# EAGLE schematic Hat_Schaltplan_1.2 (EAGLE 9.6.2)

## Sheet 1 of 2
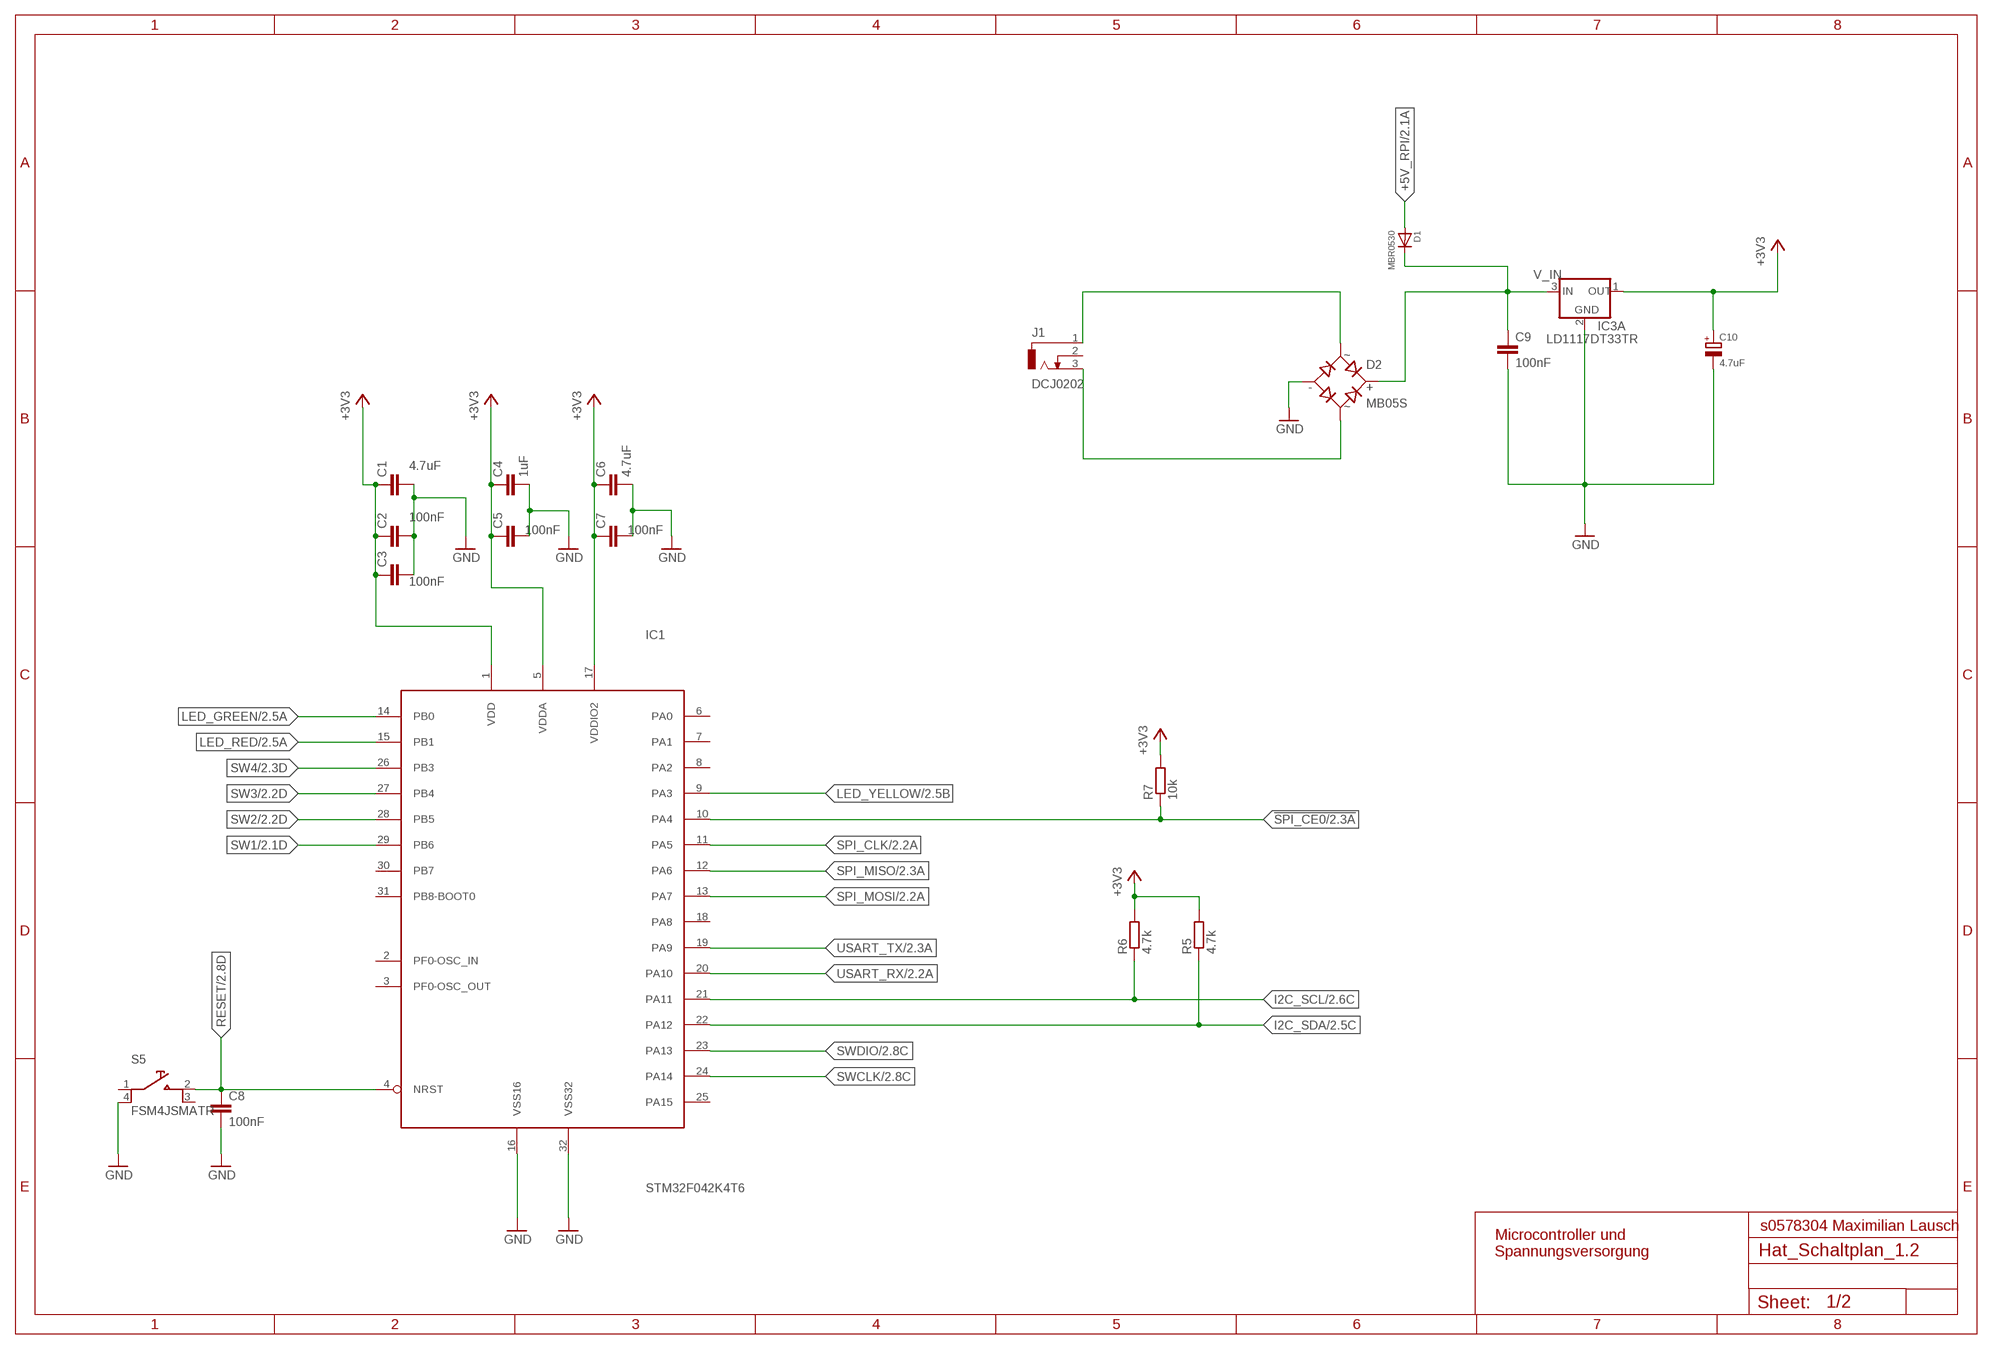
[diagram p0: schematic, sheet 1]

### Parts
C1  4.7uF  C-EUC0603  [C0603]
C2  100nF  C-EUC0603  [C0603]
C3  100nF  C-EUC0603  [C0603]
C4  1uF  C-EUC0603  [C0603]
C5  100nF  C-EUC0603  [C0603]
C6  4.7uF  C-EUC0603  [C0603]
C7  100nF  C-EUC0603  [C0603]
C8  100nF  C-EUC0603  [C0603]
C9  100nF  C-EUC0603  [C0603]
C10  4.7uF  WX-SERIES-5MM  [WX5MM]
D1  MBR0530  [SOD123]
D2  MB05S  SF-SERIES-MINI-DIL  [MINIDIL]
IC1  STM32F042K4T6  [LQPF32]
IC3  LD1117DT33TR  L78XXSOT89  [SOT89R]
J1  DCJ0202  [DCJ0202]
R5  4.7k  R-EU_R0603  [R0603]
R6  4.7k  R-EU_R0603  [R0603]
R7  10k  R-EU_R0603  [R0603]
S5  FSM4JSMATR  [FSM4JSMATR]

### Nets
!SPI_CE0: IC1.10(PA4) R7.1 ; also sheet 2
+3V3: C1.1 C2.1 C3.1 C4.1 C5.1 C6.1 C7.1 C10.+ IC1.1(VDD) IC1.5(VDDA) IC1.17(VDDIO2) IC3.1(A:OUT) R5.2 R6.2 R7.2 ; also sheet 2
+5V_RPI: D1.A ; also sheet 2
GND: C1.2 C2.2 C3.2 C4.2 C5.2 C6.2 C7.2 C8.2 C9.2 C10.- D2.- IC1.16(VSS16) IC1.32(VSS32) IC3.2(A:GND) S5.4 ; also sheet 2
I2C_SCL: IC1.21(PA11) R6.1 ; also sheet 2
I2C_SDA: IC1.22(PA12) R5.1 ; also sheet 2
LED_GREEN: IC1.14(PB0) ; also sheet 2
LED_RED: IC1.15(PB1) ; also sheet 2
LED_YELLOW: IC1.9(PA3) ; also sheet 2
N$4: D2.4(AC2) J1.3
N$5: D2.3(AC1) J1.1
RESET: C8.1 IC1.4(NRST) S5.2 ; also sheet 2
SPI_CLK: IC1.11(PA5) ; also sheet 2
SPI_MISO: IC1.12(PA6) ; also sheet 2
SPI_MOSI: IC1.13(PA7) ; also sheet 2
SW1: IC1.29(PB6) ; also sheet 2
SW2: IC1.28(PB5) ; also sheet 2
SW3: IC1.27(PB4) ; also sheet 2
SW4: IC1.26(PB3) ; also sheet 2
SWCLK: IC1.24(PA14) ; also sheet 2
SWDIO: IC1.23(PA13) ; also sheet 2
USART_RX: IC1.20(PA10) ; also sheet 2
USART_TX: IC1.19(PA9) ; also sheet 2
V_IN: C9.1 D1.K D2.+ IC3.3(A:IN)
Unconnected: IC1.2(PF0-OSC_IN) IC1.3(PF0-OSC_OUT) IC1.6(PA0) IC1.7(PA1) IC1.8(PA2) IC1.18(PA8) IC1.25(PA15) IC1.30(PB7) IC1.31(PB8-BOOT0) IC3.4 J1.2 S5.1 S5.3

### Notes on the sheet
- s0578304 Maximilian Lausch
- Microcontroller und 
  Spannungsversorgung

## Sheet 2 of 2
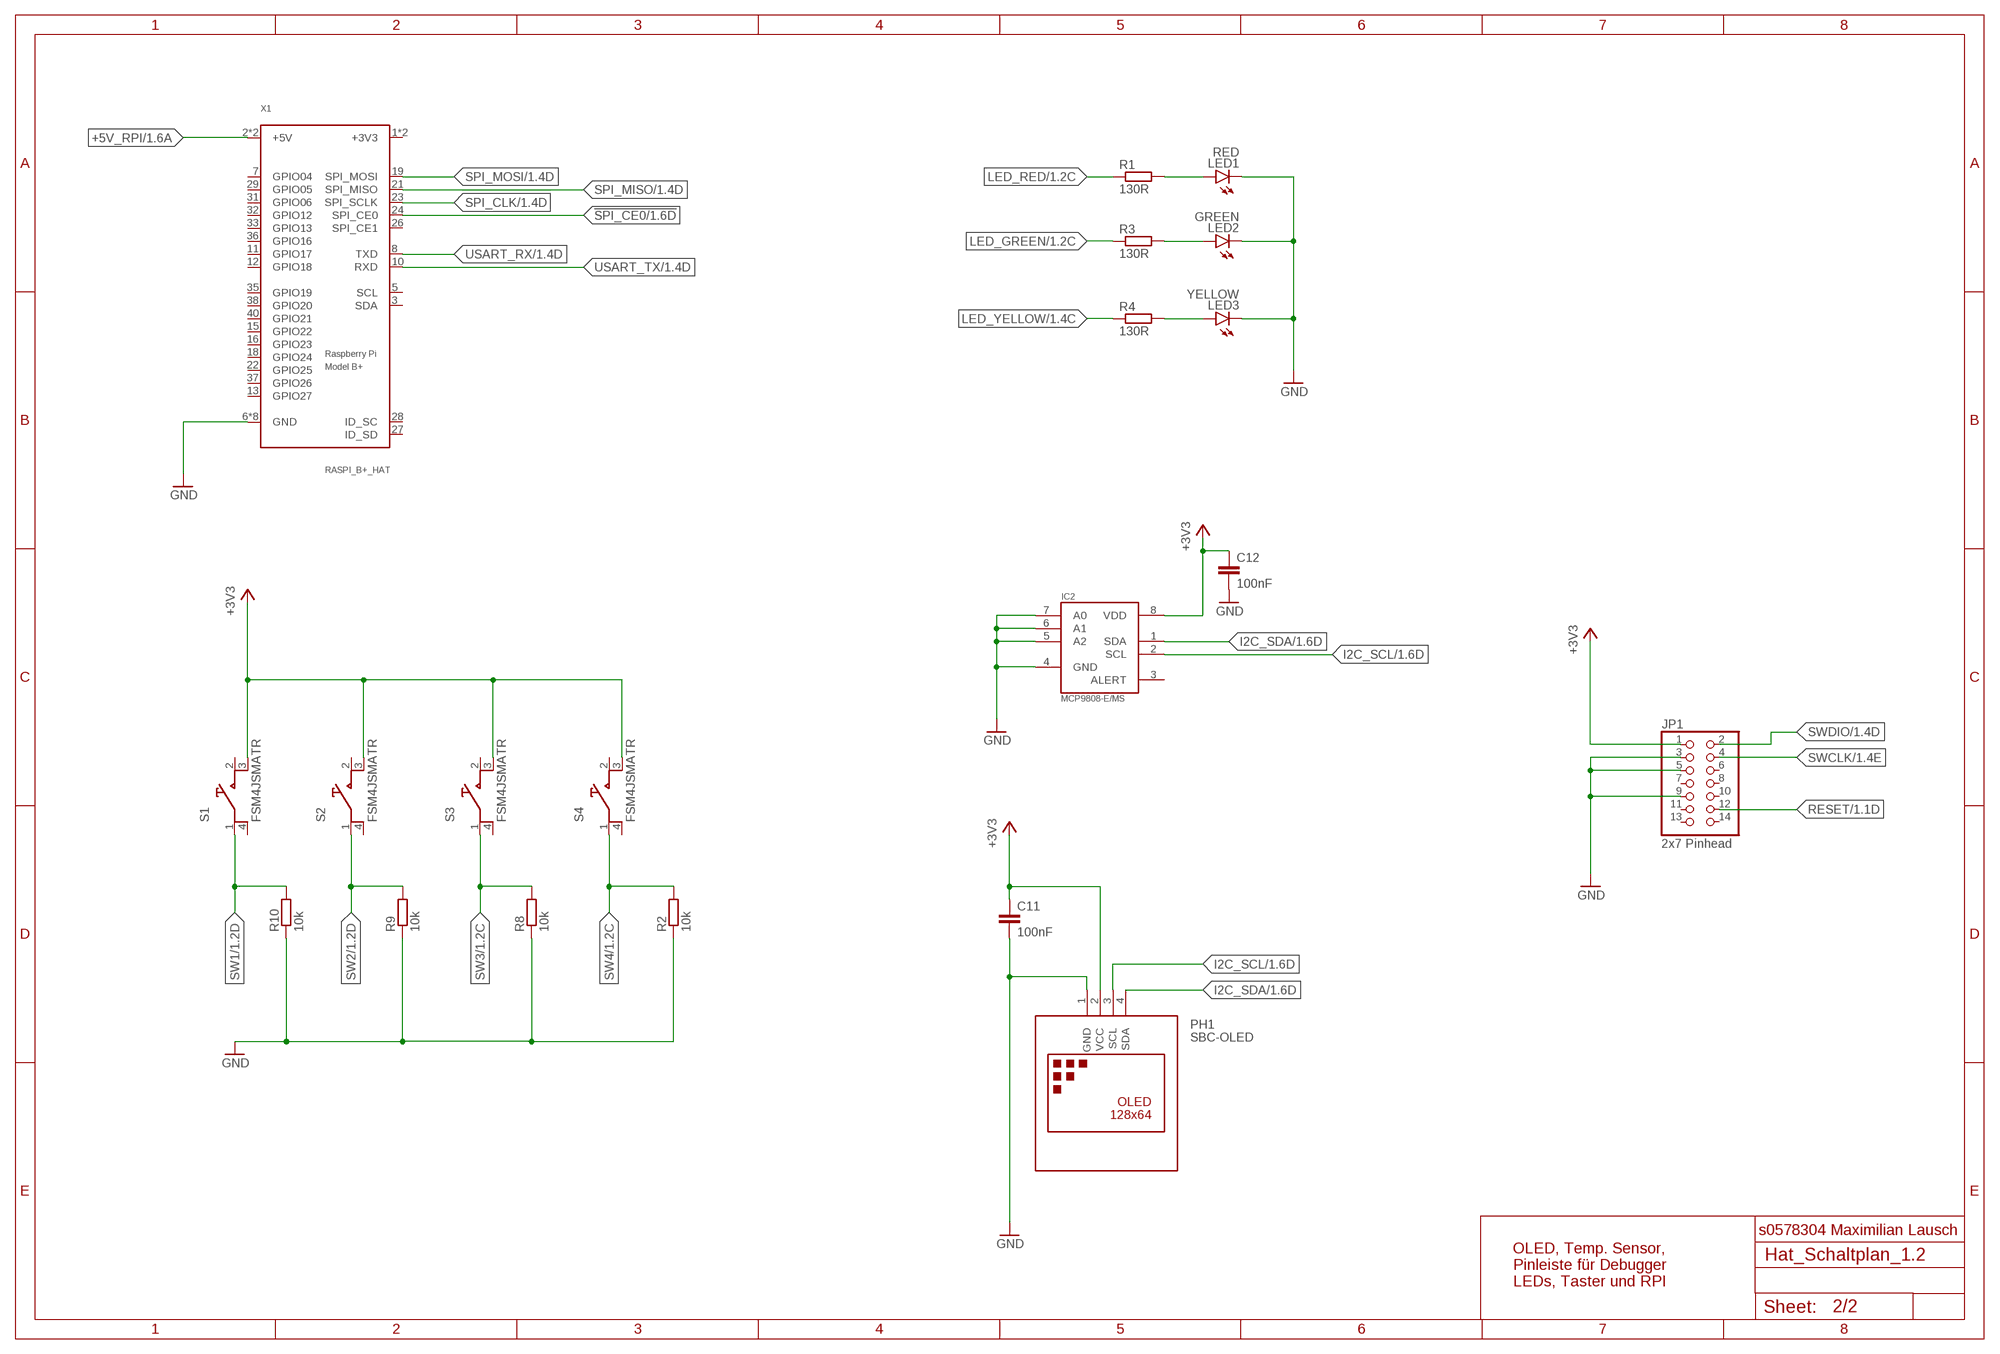
[diagram p1: schematic, sheet 2]

### Parts
C11  100nF  C-EUC0603  [C0603]
C12  100nF  C-EUC0603  [C0603]
IC2  MCP9808-E/MS  [MSOP8_0.65MM]
JP1  2x7 Pinhead  PINHD-2X7  [2X07]
LED1  RED  LED  [SMARTLED-TTW]
LED2  GREEN  LED  [SMARTLED-TTW]
LED3  YELLOW  LED  [SMARTLED-TTW]
PH1  SBC-OLED  DISPLAY-OLED-128X64-I2C  [DISPLAY-OLED-128X64-I2C]
R1  130R  R-EU_R0603  [R0603]
R2  10k  R-EU_R0603  [R0603]
R3  130R  R-EU_R0603  [R0603]
R4  130R  R-EU_R0603  [R0603]
R8  10k  R-EU_R0603  [R0603]
R9  10k  R-EU_R0603  [R0603]
R10  10k  R-EU_R0603  [R0603]
S1  FSM4JSMATR  [FSM4JSMATR]
S2  FSM4JSMATR  [FSM4JSMATR]
S3  FSM4JSMATR  [FSM4JSMATR]
S4  FSM4JSMATR  [FSM4JSMATR]
X1  RASPI_B+_HAT  [RASPI_BOARD_B+HAT]

### Nets
!SPI_CE0: X1.24(SPI_CE0) ; also sheet 1
+3V3: C11.1 C12.1 IC2.8(VDD) JP1.1 PH1.2(VCC) S1.3 S2.3 S3.3 S4.3 ; also sheet 1
+5V_RPI: X1.2(+5V) X1.4(+5V) ; also sheet 1
GND: C11.2 C12.2 IC2.4(GND) IC2.5(A2) IC2.6(A1) IC2.7(A0) JP1.3 JP1.5 JP1.9 LED1.C@1(C) LED2.C@1(C) LED3.C@1(C) PH1.1(GND) R2.1 R8.1 R9.1 R10.1 X1.6(GND) X1.9(GND) X1.14(GND) X1.20(GND) X1.25(GND) X1.30(GND) X1.34(GND) X1.39(GND) ; also sheet 1
I2C_SCL: IC2.2(SCL) PH1.3(SCL) ; also sheet 1
I2C_SDA: IC2.1(SDA) PH1.4(SDA) ; also sheet 1
LED_GREEN: R3.1 ; also sheet 1
LED_RED: R1.1 ; also sheet 1
LED_YELLOW: R4.1 ; also sheet 1
N$1: LED1.A@1(A) R1.2
N$2: LED2.A@1(A) R3.2
N$3: LED3.A@1(A) R4.2
RESET: JP1.12 ; also sheet 1
SPI_CLK: X1.23(SPI_SCLK) ; also sheet 1
SPI_MISO: X1.21(SPI_MISO) ; also sheet 1
SPI_MOSI: X1.19(SPI_MOSI) ; also sheet 1
SW1: R10.2 S1.1 ; also sheet 1
SW2: R9.2 S2.1 ; also sheet 1
SW3: R8.2 S3.1 ; also sheet 1
SW4: R2.2 S4.1 ; also sheet 1
SWCLK: JP1.4 ; also sheet 1
SWDIO: JP1.2 ; also sheet 1
USART_RX: X1.8(TXD) ; also sheet 1
USART_TX: X1.10(RXD) ; also sheet 1
Unconnected: IC2.3(ALERT) JP1.6 JP1.7 JP1.8 JP1.10 JP1.11 JP1.13 JP1.14 S1.2 S1.4 S2.2 S2.4 S3.2 S3.4 S4.2 S4.4 X1.3(SDA) X1.5(SCL) X1.7(GPIO04) X1.11(GPIO17) X1.12(GPIO18) X1.13(GPIO27) X1.15(GPIO22) X1.16(GPIO23) X1.18(GPIO24) X1.22(GPIO25) X1.26(SPI_CE1) X1.27(ID_SD) X1.28(ID_SC) X1.29(GPIO05) X1.31(GPIO06) X1.32(GPIO12) X1.33(GPIO13) X1.35(GPIO19) X1.36(GPIO16) X1.37(GPIO26) X1.38(GPIO20) X1.40(GPIO21)

### Notes on the sheet
- s0578304 Maximilian Lausch
- OLED, Temp. Sensor,
  Pinleiste für Debugger
  LEDs, Taster und RPI

## Power pins joined to a net without a drawn wire
+3V3: X1.1(+3V3) X1.17(+3V3)

## Library data of the parts
C1-C9 C11 C12 = rcl:C-EU: CAPACITOR, European symbol; SPICEPREFIX: C
C10 = TempSensor_Rev1.1:WX-SERIES
D1 = TempSensor_Rev1.1:MBR0530
D2 = TempSensor_Rev1.1:SF-SERIES
IC1 = STM32:STM32F042K; OC_FARNELL: 3365388
IC2 = TempSensor_Rev1.1:MCP9808
IC3 = TempSensor_Rev1.1:L78XX
J1 = con-jack:DCJ0202: DC POWER JACK Source: DCJ0202.pdf; OC_FARNELL: unknown; OC_NEWARK: unknown
JP1 = pinhead:PINHD-2X7: PIN HEADER
LED1-LED3 = led:LED: LED OSRAM: - CHIPLED LG R971, LG N971, LY N971, LG Q971, LY Q971, LO R971, LY R971 LH N974, LH R974 LS Q976, LO Q976, LY Q976 LO Q996 - Hyper CHIPLED LW Q18S LB Q993, LB Q99A, LB R99A - SideLED LS A670, LO A670, LY A670, LG A670, LP A670 LB A673, LV A673, LT A673, LW A673 LH A674 LY A675 LS A676, LA A676, LO A676, LY A676, LW A676 LS A679, LY A679, LG A679 - Hyper Micro SIDELED® LS Y876, LA Y876, LO Y876, LY Y876 LT Y87S - SmartLED LW L88C, LW L88S LB L89C, LB L89S, LG L890 LS L89K, LO L89K, LY L89K LS L896, LA L896, LO L896, LY L896 - TOPLED LS T670, LO T670, LY T670, LG T670, LP T670 LSG T670, LSP T670, LSY T670, LOP T670, LYG T670 LG T671, LOG T671, LSG T671 LB T673, LV T673, LT T673, LW T673 LH T674 LS T676, LA T676, LO T676, LY T676, LB T676, LH T676, LSB T676, LW T676 LB T67C, LV T67C, LT T67C, LS T67K, LO T67K, LY T67K, LW E67C LS E67B, LA E67B, LO E67B, LY E67B, LB E67C, LV E67C, LT E67C LW T67C LS T679, LY T679, LG T679 LS T770, LO T770, LY T770, LG T770, LP T770 LB T773, LV T773, LT T773, LW T773 LH T774 LS E675, LA E675, LY E675, LS T675 LS T776, LA T776, LO T776, LY T776, LB T776 LHGB T686 LT T68C, LB T68C - Hyper Mini TOPLED® LB M676 - Mini TOPLED Santana® LG M470 LS M47K, LO M47K, LY M47K Source: http://www.osram.convergy.de LUXEON: - LUMILED® LXK2-PW12-R00, LXK2-PW12-S00, LXK2-PW14-U00, LXK2-PW14-V00 LXK2-PM12-R00, LXK2-PM12-S00, LXK2-PM14-U00 LXK2-PE12-Q00, LXK2-PE12-R00, LXK2-PE12-S00, LXK2-PE14-T00, LXK2-PE14-U00 LXK2-PB12-K00, LXK2-PB12-L00, LXK2-PB12-M00, LXK2-PB14-N00, LXK2-PB14-P00, LXK2-PB14-Q00 LXK2-PR12-L00, LXK2-PR12-M00, LXK2-PR14-Q00, LXK2-PR14-R00 LXK2-PD12-Q00, LXK2-PD12-R00, LXK2-PD12-S00 LXK2-PH12-R00, LXK2-PH12-S00 LXK2-PL12-P00, LXK2-PL12-Q00, LXK2-PL12-R00 Source: www.luxeon.com KINGBRIGHT: KA-3528ASYC Source: www.kingbright.com
PH1 = TempSensor_Rev1.1:DISPLAY-OLED-128X64-I2C: 128x64 Dot Matrix OLED Module based on SSD1306 chip Variant with I2C interface More details available here: http://www.instructables.com/id/Monochrome-096-i2c-OLED-display-with-arduino-SSD13/ SSD1306 datasheet: https://cdn-shop.adafruit.com/datasheets/SSD1306.pdf Click here to find device on ebay.com <http://www.ebay.com/sch/oled+display+128x64+iic> Note: There are two variants: I2C and SPI. Search for the proper version.
R1-R10 = rcl:R-EU_: RESISTOR, European symbol; SPICEPREFIX: R
S1-S5 = TempSensor_Rev1.1:FSM4JSMATR
X1 = TempSensor_Rev1.1:RASPI_B+: Raspberry Pi GPIO connector with markings for the outer dimensions of the Raspberry Pi board model B+ with different sets of drill holes or mounting pads All pins connected